# Altium schematic sheet bq25798.SchDoc
size 381 x 241 mm; SheetNumber: 2; SheetTotal: 4
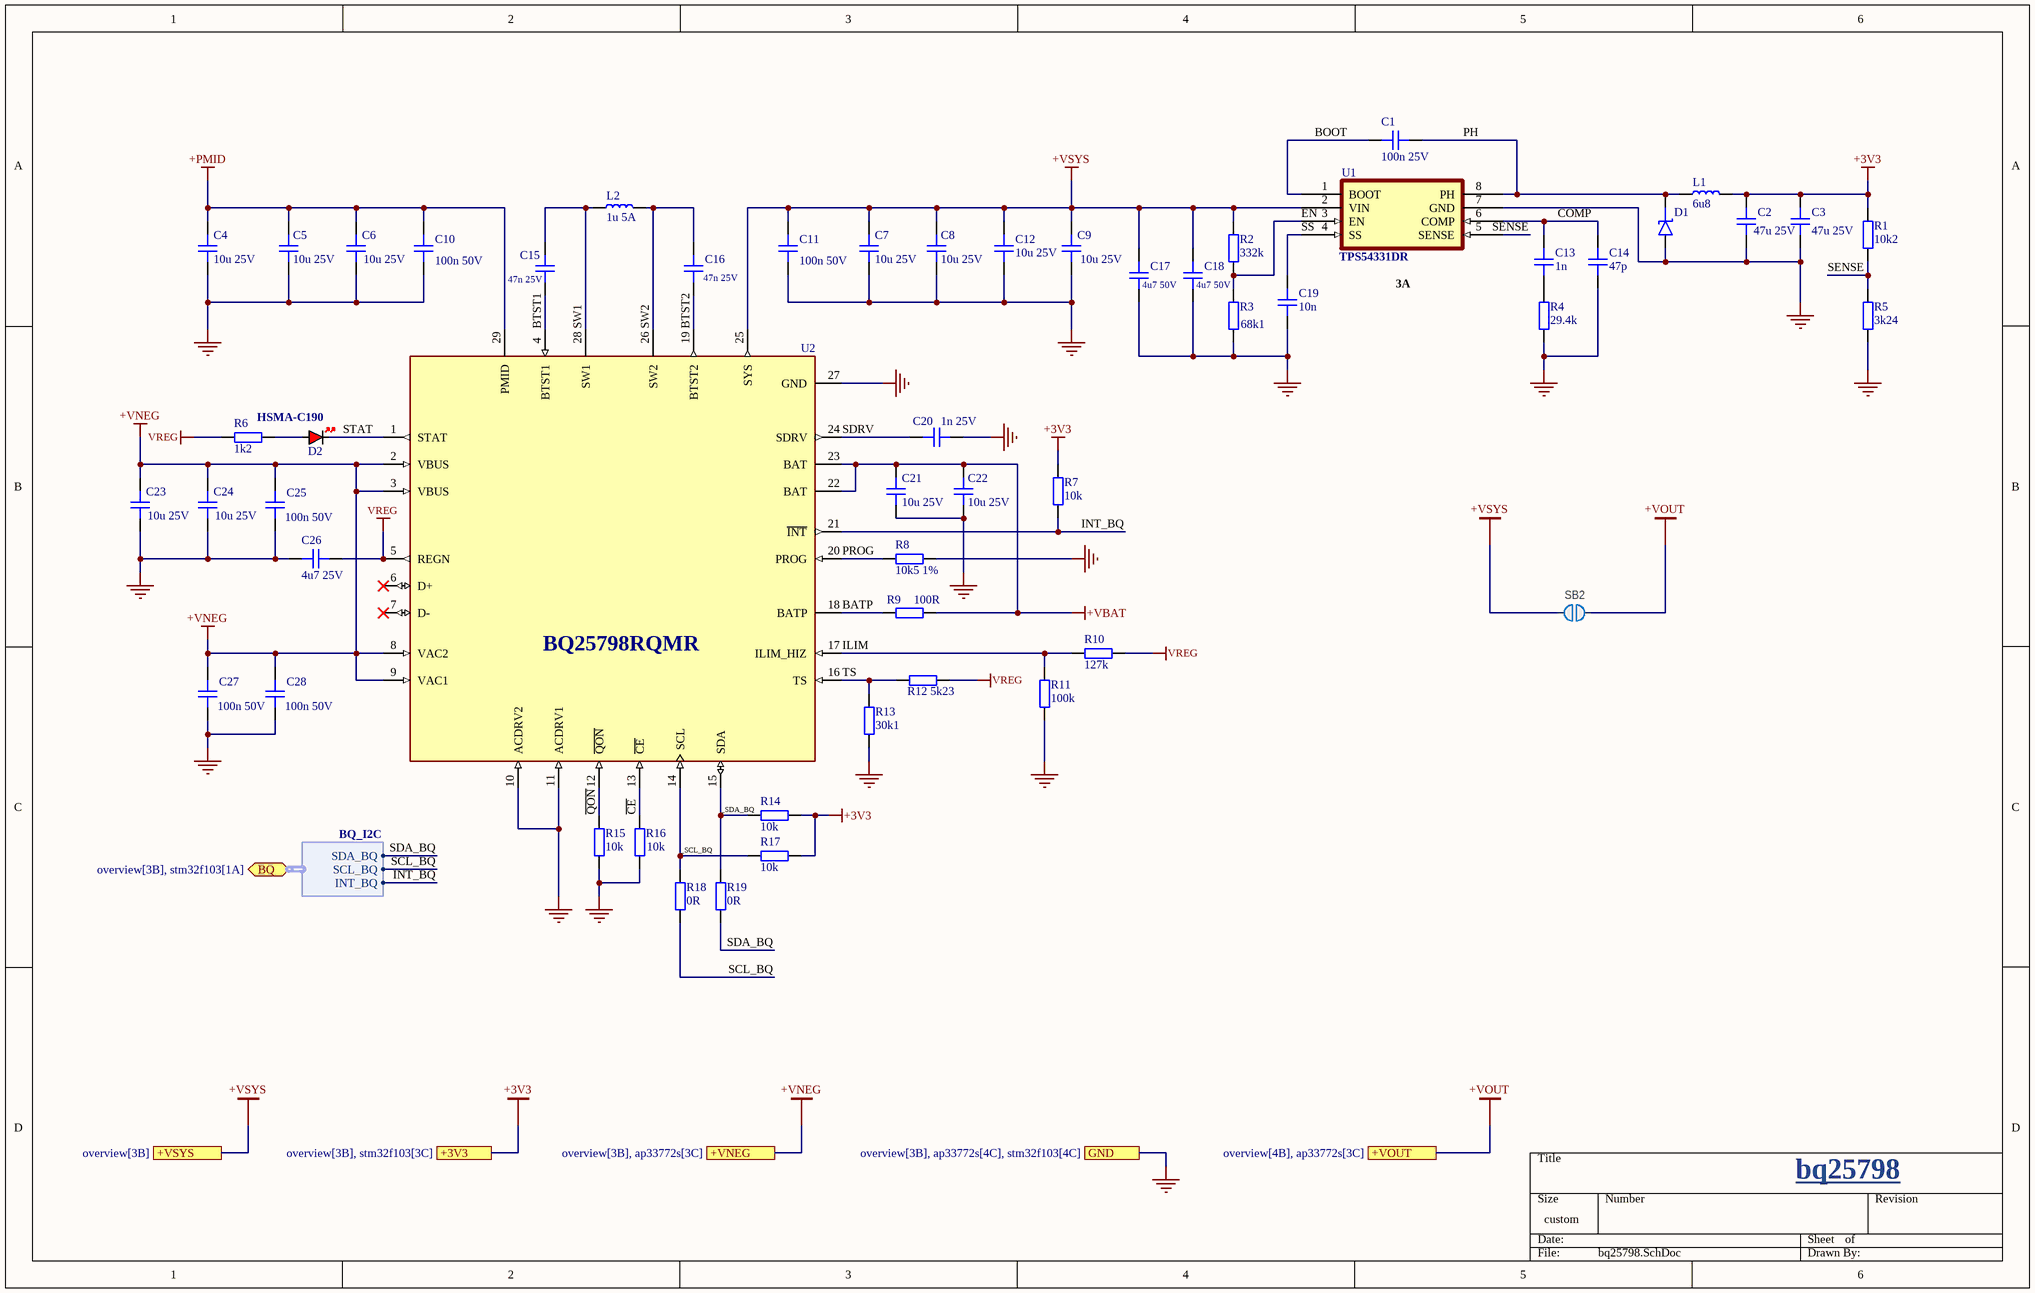
[diagram p0: bq25798.SchDoc]

## Parts
C1  100n 25V  [CAP_0805]
C2  47u 25V  [CAP_1206]
C3  47u 25V  [CAP_1206]
C4  10u 25V  [CAP_0603]
C5  10u 25V  [CAP_0603]
C6  10u 25V  [CAP_0603]
C7  10u 25V  [CAP_0603]
C8  10u 25V  [CAP_0603]
C9  10u 25V  [CAP_0603]
C10  100n 50V  [CAP_0402]
C11  100n 50V  [CAP_0402]
C12  10u 25V  [CAP_0603]
C13  1n  [CAP_0603]
C14  47p  [CAP_0402]
C15  47n 25V  [CAP_0603]
C16  47n 25V  [CAP_0603]
C17  4u7 50V  [CAP_1206]
C18  4u7 50V  [CAP_1206]
C19  10n  [CAP_0603]
C20  1n 25V  [CAP_0603]
C21  10u 25V  [CAP_0603]
C22  10u 25V  [CAP_0603]
C23  10u 25V  [CAP_0603]
C24  10u 25V  [CAP_0603]
C25  100n 50V  [CAP_0402]
C26  4u7 25V  [CAP_0402]
C27  100n 50V  [CAP_0402]
C28  100n 50V  [CAP_0402]
D1  Schottky Diode_3  [DIOM5226X100N]  (value not drawn)
D2  HSMA-C190  [LED_HSMA-C190]
L1  6u8  [ASPI-0630HI-6R8M-T15]
L2  1u 5A  [IND_AMPLA4020S1R0MT]
R1  10k2  [RES_0603]
R2  332k  [RES_0603]
R3  68k1  [RES_0805]
R4  29.4k  [RES_0603]
R5  3k24  [RES_0603]
R6  1k2  [RES_0603]
R7  10k  [RES_0603]
R8  10k5 1%  [RES_0603]
R9  100R  [RES_0603]
R10  127k  [RES_0603]
R11  100k  [RES_0603]
R12  5k23  [RES_0603]
R13  30k1  [RES_0603]
R14  10k  [RES_0603]
R15  10k  [RES_0603]
R16  10k  [RES_0603]
R17  10k  [RES_0603]
R18  0R  [RES_0603]
R19  0R  [RES_0603]
SB2  Solderbridge  [Solderbridge]  (value not drawn)  (no BOM)
U1  TPS54331DR  [SOIC127P599X175-8N]
U2  BQ25798RQMR  [IC_BQ25798RQMR]

## Ports
+3V3 (see overview[3B], stm32f103[3C]), +VNEG (see overview[3B], ap33772s[3C]), +VOUT (see overview[4B], ap33772s[3C]), +VSYS (see overview[3B]), BQ (bidir, harness BQ_I2C, see overview[3B], stm32f103[1A]), GND (see overview[3B], ap33772s[4C], stm32f103[4C])

## Harnesses
BQ_I2C: SDA_BQ, SCL_BQ, INT_BQ

## Nets
+3V3: C2.2 C3.2 L1.2 R1.2 R7.2 R14.2 R17.1 ; port +3V3
+PMID: C4.2 C5.2 C6.2 C10.2 U2.29(PMID)
+VBAT: C21.2 C22.2 R9.2 U2.22(BAT) U2.23(BAT)
+VNEG: C23.2 C24.2 C25.2 C27.2 C28.2 U2.2(VBUS) U2.3(VBUS) U2.8(VAC2) U2.9(VAC1) ; port +VNEG
+VOUT: SB2.1 ; port +VOUT
+VSYS: C7.2 C8.2 C9.2 C11.2 C12.2 C17.2 C18.2 R2.2 SB2.2 U1.2(VIN) U2.25(SYS) ; port +VSYS
GND: C2.1 C3.1 C4.1 C5.1 C6.1 C7.1 C8.1 C9.1 C10.1 C11.1 C12.1 C14.1 C17.1 C18.1 C19.1 C20.2 C21.1 C22.1 C23.1 C24.1 C25.1 C26.2 C27.1 C28.1 D1.A R3.1 R4.1 R5.1 R8.1 R11.1 R13.1 R15.1 R16.1 U1.7(GND) U2.10(ACDRV2) U2.11(ACDRV1) U2.27(GND) ; port GND
VREG: C26.1 R6.1 R10.2 R12.2 U2.5(REGN)
_SCL_BQ: R17.2 R18.1 U2.14(SCL)
_SDA_BQ: R14.1 R19.2 U2.15(SDA)
BATP: R9.1 U2.18(BATP)
BOOT: C1.1 U1.1(BOOT)
BTST1: C15.1 U2.4(BTST1)
BTST2: C16.1 U2.19(BTST2)
~{CE}: R16.2 U2.13(~{CE})
COMP: C13.2 C14.2 U1.6(COMP)
EN: R2.1 R3.2 U1.3(EN)
ILIM: R10.1 R11.2 U2.17(ILIM_HIZ)
INT_BQ: R7.1 U2.21(~{INT}) ; port BQ.INT_BQ
PH: C1.2 D1.K L1.1 U1.8(PH)
PROG: R8.2 U2.20(PROG)
~{QON}: R15.2 U2.12(~{QON})
SCL_BQ: R18.2 ; port BQ.SCL_BQ
SDA_BQ: R19.1 ; port BQ.SDA_BQ
SDRV: C20.1 U2.24(SDRV)
SENSE: R1.1 R5.2 U1.5(SENSE)
SS: C19.2 U1.4(SS)
STAT: D2.K U2.1(STAT)
SW1: C15.2 L2.1 U2.28(SW1)
SW2: C16.2 L2.2 U2.26(SW2)
TS: R12.1 R13.2 U2.16(TS)
NetC13_1: C13.1 R4.2
NetD2_A: D2.A R6.2

Not connected (* = marked no-connect by the designer): U2 6(D+)* 7(D-)*

## Notes on the sheet
- (near U1) 3A
- bq25798

## Library data of the parts
C1 = CAP_0805: Capacitor SMD 0805; Manufacturer: *; Manufacturer Part Number: *; Distributor Link: *; LCSC: *; Rating: *; Dielectric: *
C2 C3 C17 C18 = CAP_1206: Capacitor SMD 1206; Manufacturer: *; Manufacturer Part Number: *; Distributor Link: *; LCSC: *; Rating: *; Dielectric: *
C4-C9 C12 C13 C15 C16 C19-C24 = CAP_0603: Capacitor SMD 0603; Manufacturer: *; Manufacturer Part Number: *; Distributor Link: *; LCSC: *; Rating: *; Dielectric: *
C10 C11 C14 C25-C28 = CAP_0402: Capacitor SMD 0402; Manufacturer: *; Manufacturer Part Number: *; Distributor Link: *; LCSC: *; Rating: *; Dielectric: *
D1 = Schottky Diode_3: Schottky Diode SMD SMAF package
D2 = HSMA-C190: 20mA White Lens 90mcd 592nm Amber 170° 1.9V 0603 LED Indication - Discrete ROHS; Package: None; Price: None; Value: *; MP: HSMA-C190; Availability: Unavailable
L1 = ASPI-0630HI-6R8M-T15: Inductor SMD 6.8uH 20% 8A Shielded; Manufacturer: ABRACON; Manufacturer Part Number: ASPI-0630HI-6R8M-T15
L2 = AMPLA4020S1R0MT: Inductor Power Shielded/Molded Wirewound 1uH 20% 100KHz Carbonyl Powder 5A 0.027Ohm DCR 1616 T/R; MF: Abracon; SnapEDA_Link: https://www.snapeda.com/parts/AMPLA4020S1R0MT/Abracon/view-part/?ref=snap; Package: Package; Value: *; MP: AMPLA4020S1R0MT; Check_prices: https://www.snapeda.com/parts/AMPLA4020S1R0MT/Abracon/view-part/?ref=eda
R1 R2 R4-R19 = RES_0603: Resistor SMD 0603; Manufacturer: *; Manufacturer Part Number: *; Distributor Link: *; LCSC: *
R3 = RES_0805: Resistor SMD 0805; Manufacturer: *; Manufacturer Part Number: *; Distributor Link: *; LCSC: *
SB2 = Solderbridge: Manufacturer: N.A.; Part number NEMS: 100500458; Pad Count: 2; Component Status: Active; System: Connector; Part Number: Solderbridge; Manufacturer Part Number: N.A.; LatestRevisionDate: 2009-12-14; Published: 2009-12-14; Value: Solderbridge; Note: N.A.; Artikkelnr Noca: N.A.; Footprint Doc: Solderbridge; Part number IPS: N.A.; ComponentLink1URL: N.A.; ComponentLink1Description: Datasheet; ComponentLink2URL: N.A.; ComponentLink2Description: Supplier link; HelpURL: N.A.; Supplier 1: N.A.; Supplier Part Number 1: N.A.; Supplier 2: N.A.; Supplier Part Number 2: N.A.; PartId: 100500458; Component Class: Connectors; Author: rsk; Part number Norautron: N.A.
U2 = BQ25798RQMR: IÂ²C controlled, 1-4-cell, 5-A buck-boost solar battery charger with dual-input selector and MPPT; MF: Texas Instruments; SnapEDA_Link: https://www.snapeda.com/parts/BQ25798RQMR/Texas+Instruments/view-part/?ref=snap; Package: VFQFN-29 Texas Instruments; Value: *; MP: BQ25798RQMR; Check_prices: https://www.snapeda.com/parts/BQ25798RQMR/Texas+Instruments/view-part/?ref=eda